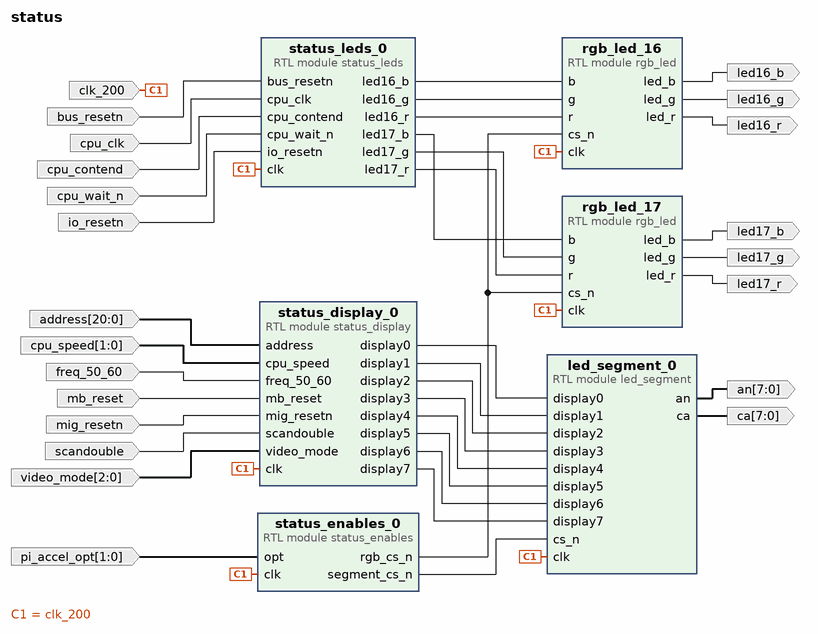
[diagram p0: block diagram of the top level]
# Vivado block design status, xc7a100tcsg324-1, Vivado 2021.2.1
create_bd_design status

create_bd_port -dir I cpu_contend
create_bd_port -dir I cpu_wait_n
create_bd_port -dir I cpu_clk
create_bd_port -dir I freq_50_60
create_bd_port -dir I scandouble
create_bd_port -dir I -from 2 -to 0 video_mode
create_bd_port -dir I -from 20 -to 0 address
create_bd_port -dir I -from 1 -to 0 cpu_speed
create_bd_port -dir O -from 7 -to 0 an
create_bd_port -dir O -from 7 -to 0 ca
create_bd_port -dir O led16_r
create_bd_port -dir O led16_g
create_bd_port -dir O led16_b
create_bd_port -dir O led17_r
create_bd_port -dir O led17_g
create_bd_port -dir O led17_b
create_bd_port -dir I -type rst mb_reset
set_property -dict {CONFIG.POLARITY ACTIVE_HIGH} [get_bd_ports mb_reset]
create_bd_port -dir I -type clk clk_200
set_property -dict {CONFIG.FREQ_HZ 200000000} [get_bd_ports clk_200]
create_bd_port -dir I -type rst mig_resetn
create_bd_port -dir I -from 1 -to 0 pi_accel_opt
create_bd_port -dir I -type rst io_resetn
create_bd_port -dir I -type rst bus_resetn

create_bd_cell -type module -reference led_segment led_segment_0
create_bd_cell -type module -reference rgb_led rgb_led_16
create_bd_cell -type module -reference rgb_led rgb_led_17
create_bd_cell -type module -reference status_enables status_enables_0
create_bd_cell -type module -reference status_display status_display_0
create_bd_cell -type module -reference status_leds status_leds_0

# ---- connections ----

connect_bd_net [get_bd_ports address] [get_bd_pins status_display_0/address]
connect_bd_net [get_bd_ports bus_resetn] [get_bd_pins status_leds_0/bus_resetn]
connect_bd_net -net clk_system_1 [get_bd_ports clk_200] \
  [get_bd_pins led_segment_0/clk] [get_bd_pins rgb_led_16/clk] [get_bd_pins rgb_led_17/clk] \
  [get_bd_pins status_enables_0/clk] [get_bd_pins status_display_0/clk] [get_bd_pins status_leds_0/clk]
connect_bd_net [get_bd_ports cpu_clk] [get_bd_pins status_leds_0/cpu_clk]
connect_bd_net [get_bd_ports cpu_contend] [get_bd_pins status_leds_0/cpu_contend]
connect_bd_net [get_bd_ports cpu_speed] [get_bd_pins status_display_0/cpu_speed]
connect_bd_net [get_bd_ports cpu_wait_n] [get_bd_pins status_leds_0/cpu_wait_n]
connect_bd_net -net enables_1 [get_bd_ports pi_accel_opt] [get_bd_pins status_enables_0/opt]
connect_bd_net -net freq_50_60_1 [get_bd_ports freq_50_60] [get_bd_pins status_display_0/freq_50_60]
connect_bd_net [get_bd_ports io_resetn] [get_bd_pins status_leds_0/io_resetn]
connect_bd_net [get_bd_pins led_segment_0/an] [get_bd_ports an]
connect_bd_net [get_bd_pins led_segment_0/ca] [get_bd_ports ca]
connect_bd_net [get_bd_ports mb_reset] [get_bd_pins status_display_0/mb_reset]
connect_bd_net [get_bd_ports mig_resetn] [get_bd_pins status_display_0/mig_resetn]
connect_bd_net [get_bd_pins rgb_led_16/led_b] [get_bd_ports led16_b]
connect_bd_net [get_bd_pins rgb_led_16/led_g] [get_bd_ports led16_g]
connect_bd_net [get_bd_pins rgb_led_16/led_r] [get_bd_ports led16_r]
connect_bd_net [get_bd_pins rgb_led_17/led_b] [get_bd_ports led17_b]
connect_bd_net [get_bd_pins rgb_led_17/led_g] [get_bd_ports led17_g]
connect_bd_net [get_bd_pins rgb_led_17/led_r] [get_bd_ports led17_r]
connect_bd_net [get_bd_ports scandouble] [get_bd_pins status_display_0/scandouble]
connect_bd_net [get_bd_pins status_display_0/display0] [get_bd_pins led_segment_0/display0]
connect_bd_net [get_bd_pins status_display_0/display1] [get_bd_pins led_segment_0/display1]
connect_bd_net [get_bd_pins status_display_0/display2] [get_bd_pins led_segment_0/display2]
connect_bd_net [get_bd_pins status_display_0/display3] [get_bd_pins led_segment_0/display3]
connect_bd_net [get_bd_pins status_display_0/display4] [get_bd_pins led_segment_0/display4]
connect_bd_net [get_bd_pins status_display_0/display5] [get_bd_pins led_segment_0/display5]
connect_bd_net [get_bd_pins status_display_0/display6] [get_bd_pins led_segment_0/display6]
connect_bd_net [get_bd_pins status_display_0/display7] [get_bd_pins led_segment_0/display7]
connect_bd_net [get_bd_pins status_enables_0/rgb_cs_n] [get_bd_pins rgb_led_16/cs_n] [get_bd_pins rgb_led_17/cs_n]
connect_bd_net [get_bd_pins status_enables_0/segment_cs_n] [get_bd_pins led_segment_0/cs_n]
connect_bd_net [get_bd_pins status_leds_0/led16_b] [get_bd_pins rgb_led_16/b]
connect_bd_net [get_bd_pins status_leds_0/led16_g] [get_bd_pins rgb_led_16/g]
connect_bd_net [get_bd_pins status_leds_0/led16_r] [get_bd_pins rgb_led_16/r]
connect_bd_net [get_bd_pins status_leds_0/led17_b] [get_bd_pins rgb_led_17/b]
connect_bd_net [get_bd_pins status_leds_0/led17_g] [get_bd_pins rgb_led_17/g]
connect_bd_net [get_bd_pins status_leds_0/led17_r] [get_bd_pins rgb_led_17/r]
connect_bd_net [get_bd_ports video_mode] [get_bd_pins status_display_0/video_mode]

validate_bd_design
save_bd_design
